# Altium schematic sheet MCU.SchDoc (part 1 of 3)
size A2; SheetNumber: 2; SheetTotal: 8
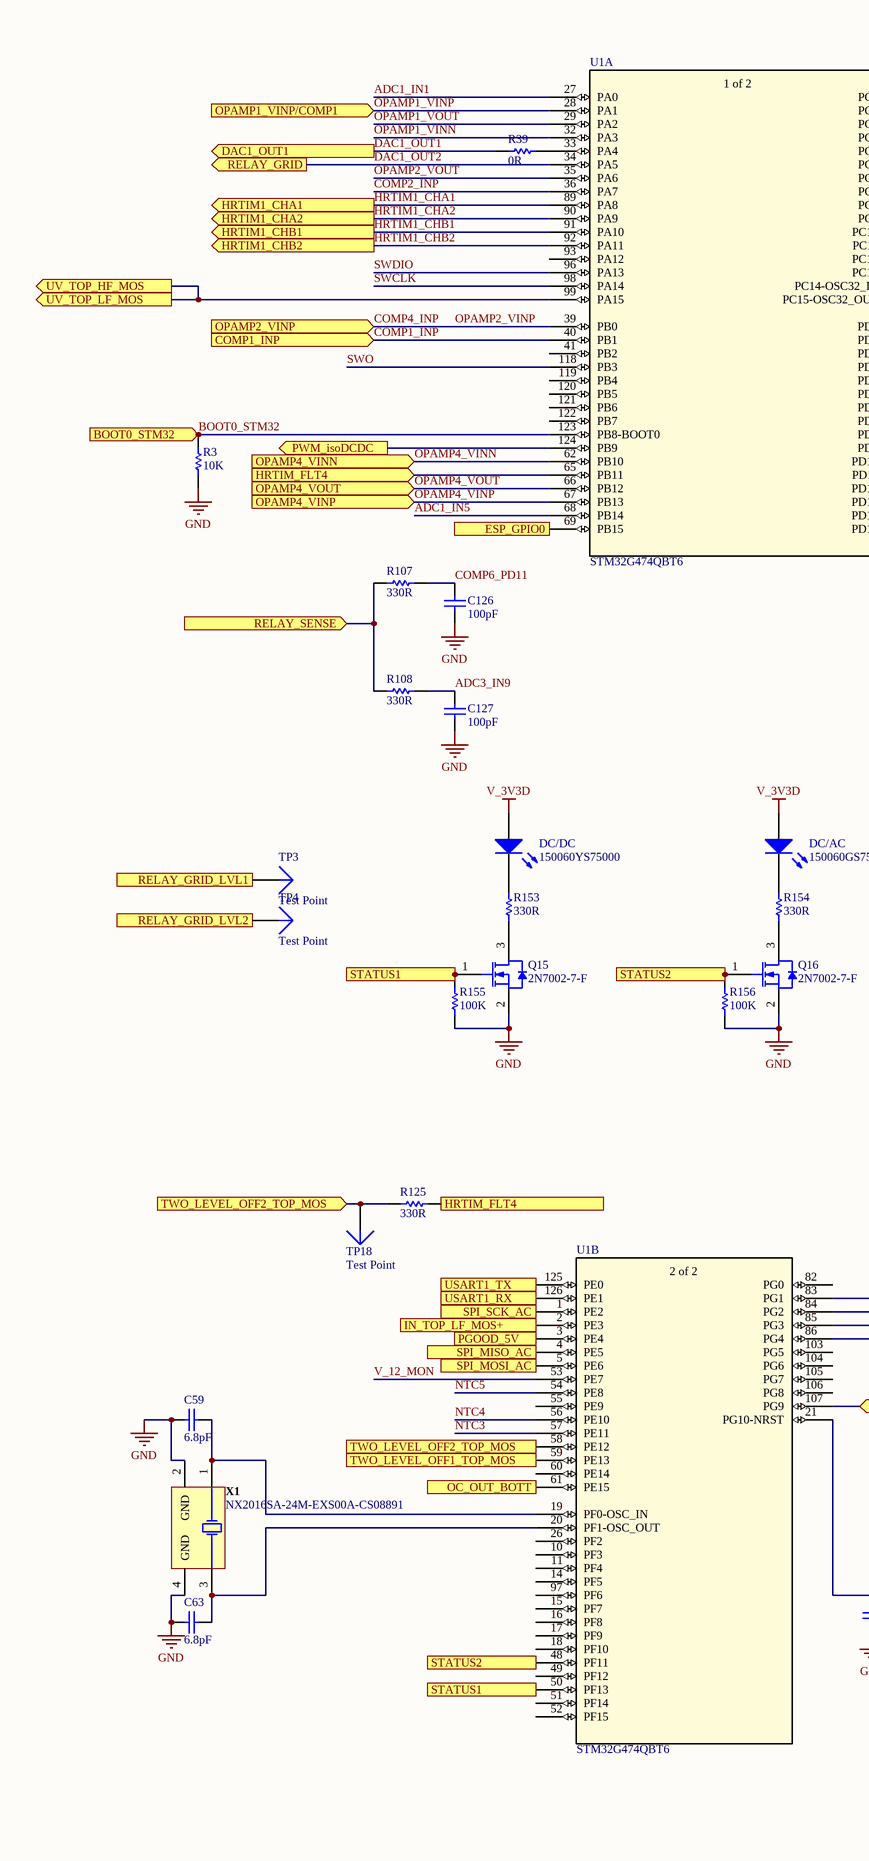
[diagram p0: MCU.SchDoc, left]
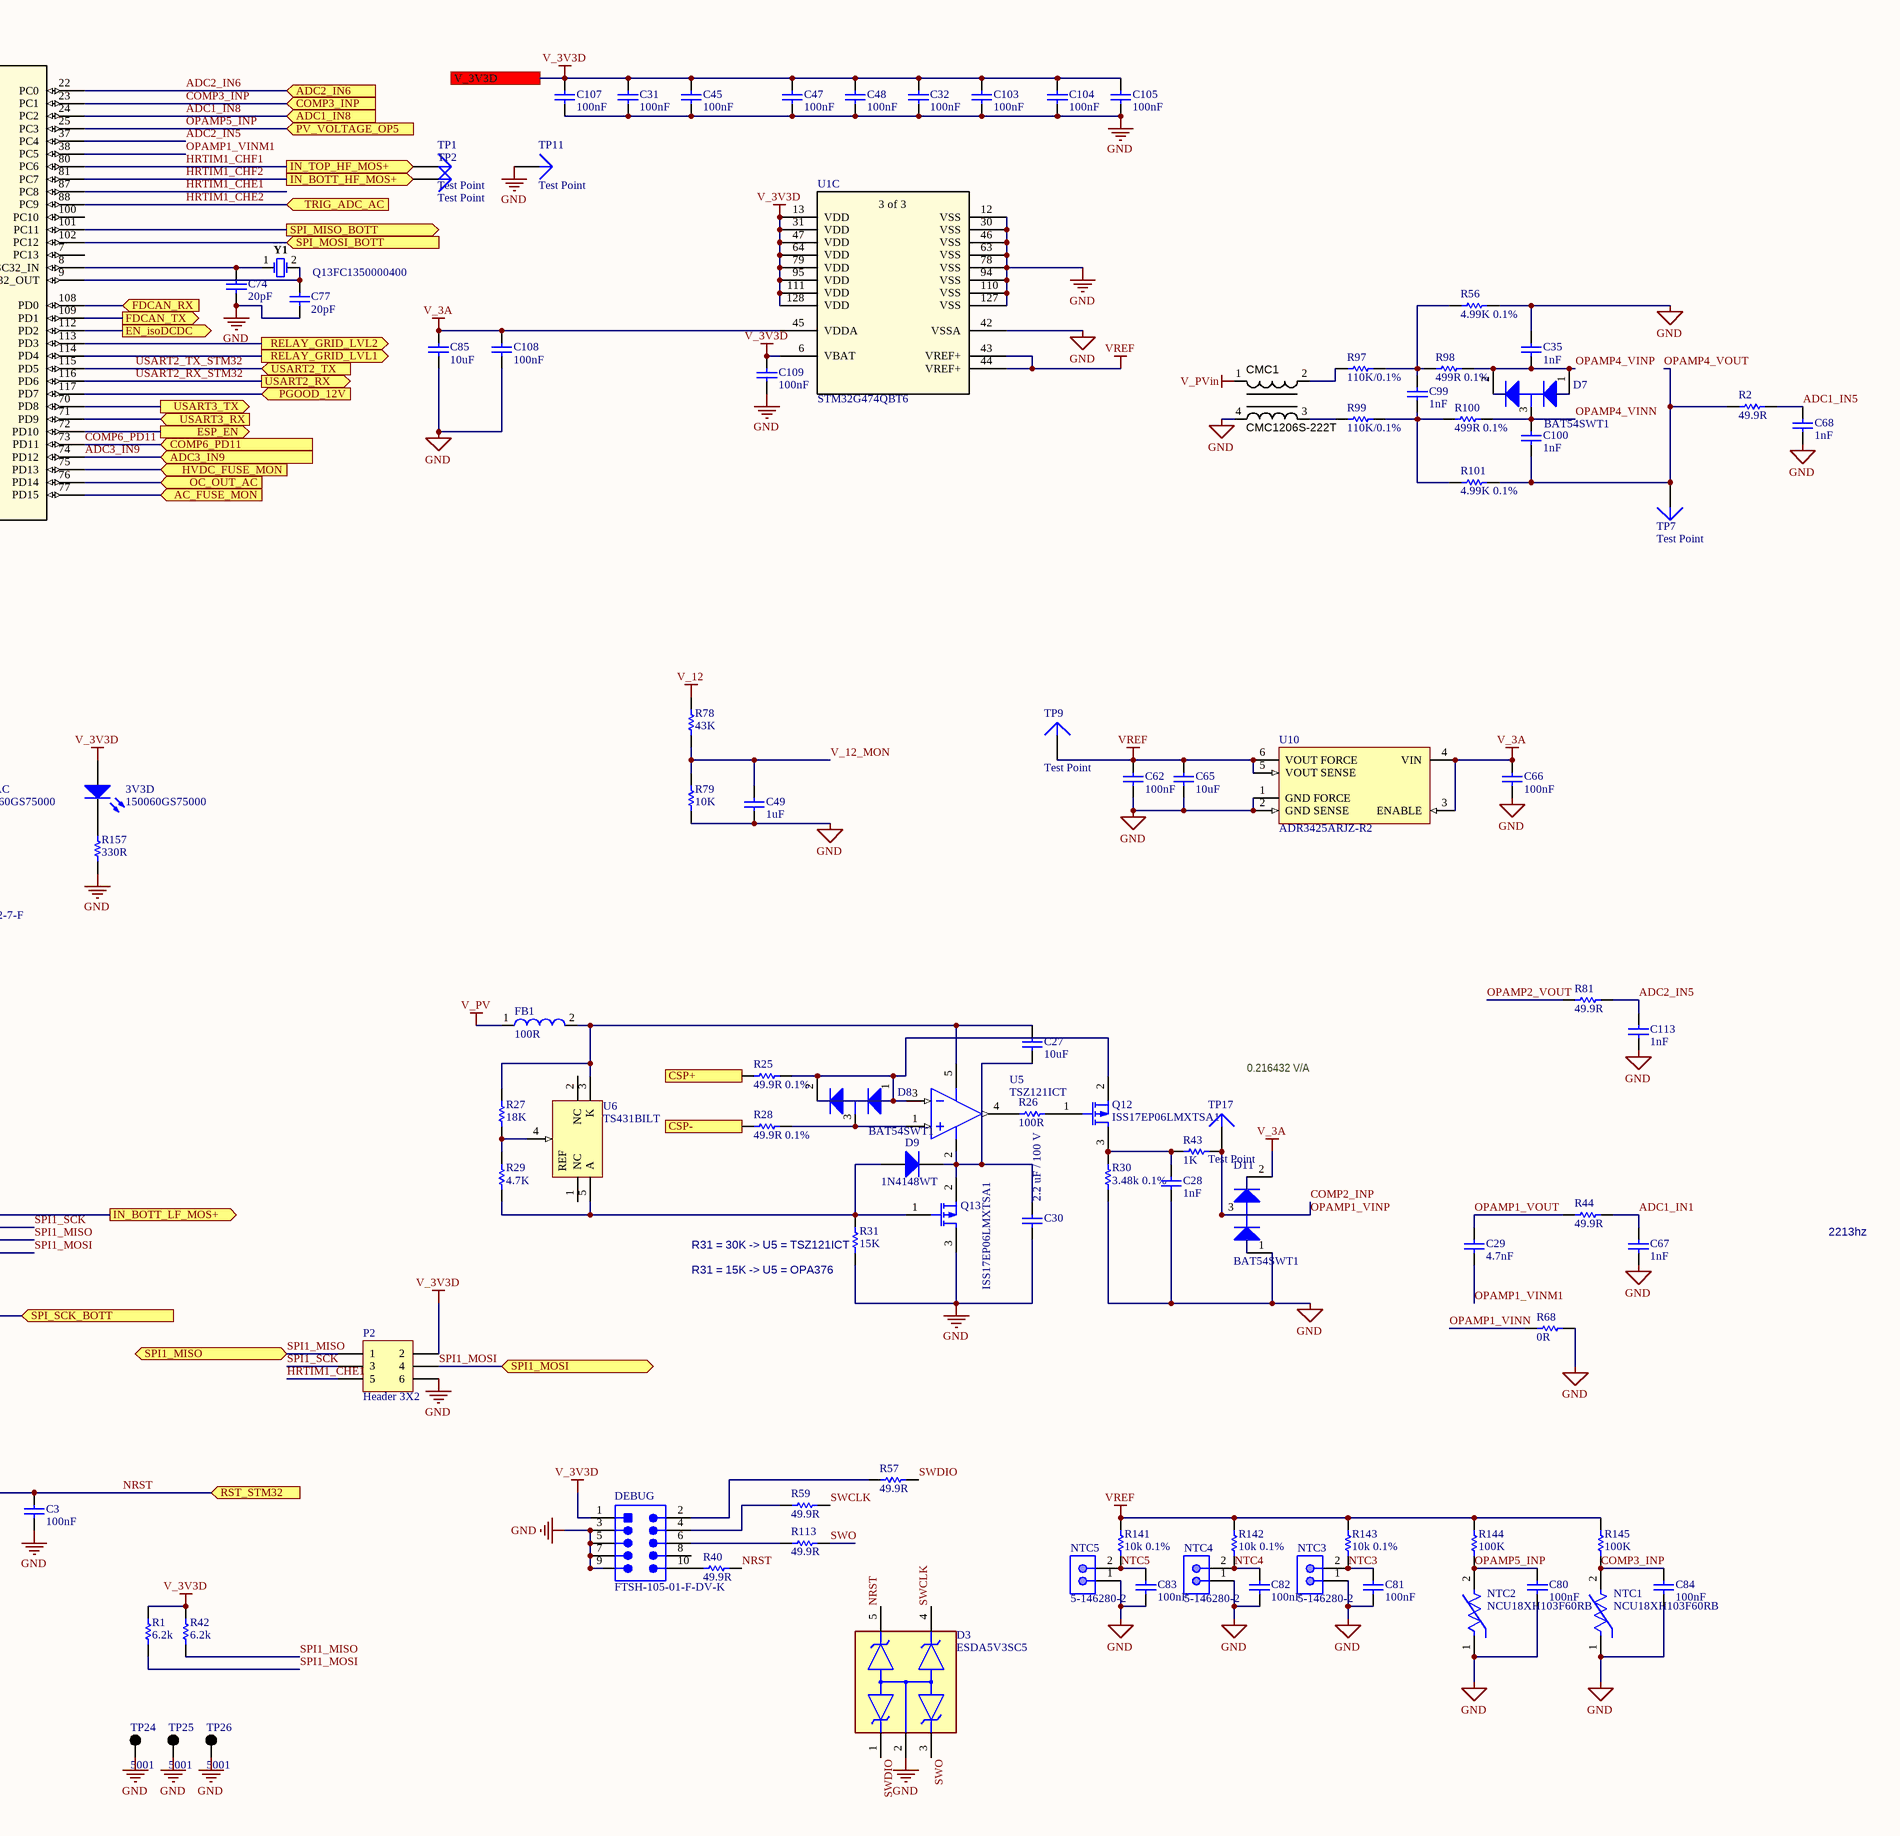
[diagram p1: MCU.SchDoc, right]

## Parts
3V3D  150060GS75000  [0603_A]
C3  100nF  [CAPC1005X56X25NL10T15]
C27  10uF  [CAPC2013X140X45NL15T25]
C28  1nF  [CAPC1608X90X35NL15T15]
C29  4.7nF  [CAPC1608X90X20NL10]
C30  2.2 uF / 100 V  [CAPC3225X250X20LL40]
C31  100nF  [CAPC1608X90X35NL10T15]
C32  100nF  [CAPC1608X90X35NL10T15]
C35  1nF  [CAPC1608X90X35NL15T15]
C45  100nF  [CAPC1608X90X35NL10T15]
C47  100nF  [CAPC1608X90X35NL10T15]
C48  100nF  [CAPC1608X90X35NL10T15]
C49  1uF  [CAPC1608X86X35NL15T15]
C59  6.8pF  [CAPC1005X56X25LL10T15]
C62  100nF  [CAPC1005X56X25NL10T15]
C63  6.8pF  [CAPC1005X56X25LL10T15]
C65  10uF  [CAPC1608X90X40NL10T20]
C66  100nF  [CAPC1608X90X35NL10T15]
C67  1nF  [CAPC1005X56X25NL10T15]
C68  1nF  [CAPC1608X90X35NL15T15]
C74  20pF  [CAPC1005X55X25ML05T10]
C77  20pF  [CAPC1005X55X25ML05T10]
C80  100nF  [CAPC1608X90X35NL10T15]
C81  100nF  [CAPC1608X90X35NL10T15]
C82  100nF  [CAPC1608X90X35NL10T15]
C83  100nF  [CAPC1608X90X35NL10T15]
C84  100nF  [CAPC1608X90X35NL10T15]
C85  10uF  [CAPC2013X140X45NL15T25]
C99  1nF  [CAPC1608X90X35NL15T15]
C100  1nF  [CAPC1608X90X35NL15T15]
C103  100nF  [CAPC1608X90X35NL10T15]
C104  100nF  [CAPC1608X90X35NL10T15]
C105  100nF  [CAPC1608X90X35NL10T15]
C107  100nF  [CAPC1608X90X35NL10T15]
C108  100nF  [CAPC1608X90X35NL10T15]
C109  100nF  [CAPC1608X90X35NL10T15]
C113  1nF  [CAPC1005X56X25NL10T15]
C126  100pF  [CAPC1608X90X35NL10T15]
C127  100pF  [CAPC1608X90X35NL10T15]
CMC1  CMC1206S-222T  [CHOKE_CM_1206SMD]
D3  ESDA5V3SC5  [FP-SOT323-5L-MFG]
D7  BAT54SWT1  [ONSC-SOT-323-3-419-04_V]
D8  BAT54SWT1  [ONSC-SOT-323-3-419-04_V]
D9  1N4148WT  [FAIR-SOD-523F-2_V]
D11  BAT54SWT1  [ONSC-SOT-323-3-419-04_V]
DC/AC  150060GS75000  [0603_A]
DC/DC  150060YS75000  [0603_A]
DEBUG  FTSH-105-01-F-DV-K  [SMTC-FTSH-105-01-L-DV-K_V]
FB1  100R  [SMD-0603]
NTC1  NCU18XH103F60RB  [FP-NCU18-0_15-MFG]
NTC2  NCU18XH103F60RB  [FP-NCU18-0_15-MFG]
NTC3  5-146280-2  [TECO-5-146280-2_V]
NTC4  5-146280-2  [TECO-5-146280-2_V]
NTC5  5-146280-2  [TECO-5-146280-2_V]
P2  Header 3X2  [HDR2X3]
Q12  ISS17EP06LMXTSA1  [INF-PG-SOT23_N]
Q13  ISS17EP06LMXTSA1  [INF-PG-SOT23_N]
Q15  2N7002-7-F  [DIOD-SOT23-3_V]
Q16  2N7002-7-F  [DIOD-SOT23-3_V]
R1  6.2k  [RESC1608X55X25ML10T15]
R2  49.9R  [RESC1608X55X30ML15T15]
R3  10K  [RESC1608X55X25NL10T15]
R25  49.9R 0.1%  [RESC1608X55X25ML10T15]
R26  100R  [RESC1608X55X30LL15T15]
R27  18K  [RESC1608X55X30NL20T20]
R28  49.9R 0.1%  [RESC1608X55X25ML10T15]
R29  4.7K  [RESC1608X55X30ML15T15]
R30  3.48k 0.1%  [RESC1608X55X30NL20T20]
R31  15K  [RESC1608X55X30NL15T15]
R39  0R  [RESC1608X55X25ML10T15]
R40  49.9R  [RESC1608X55X30NL15T15]
R42  6.2k  [RESC1608X55X25ML10T15]
R43  1K  [RESC1608X55X30NL15T15]
R44  49.9R  [RESC1608X55X30NL15T15]
R56  4.99K 0.1%  [RESC1608X55X30ML20T20]
R57  49.9R  [RESC1608X55X30NL15T15]
R59  49.9R  [RESC1608X55X30NL15T15]
R68  0R  [RESC1608X55X25ML10T15]
R78  43K  [RESC1608X55X30NL20T20]
R79  10K  [RESC1608X55X25NL10T15]
R81  49.9R  [RESC1005X40X25NL05T05]
R97  110K/0.1%  [RESC1608X55X30NL20T20]
R98  499R 0.1%  [RESC1608X55N]
R99  110K/0.1%  [RESC1608X55X30NL20T20]
R100  499R 0.1%  [RESC1608X55N]
R101  4.99K 0.1%  [RESC1608X55X30ML20T20]
R107  330R  [RESC1608X55X25NL10T15]
R108  330R  [RESC1608X55X25NL10T15]
R113  49.9R  [RESC1608X55X30NL15T15]
R125  330R  [RESC1608X55X25NL10T15]
R141  10k 0.1%  [RESC1608X55X30ML20T20]
R142  10k 0.1%  [RESC1608X55X30ML20T20]
R143  10k 0.1%  [RESC1608X55X30ML20T20]
R144  100K  [RESC1608X55X25NL10T15]
R145  100K  [RESC1608X55X25NL10T15]
R153  330R  [RESC1608X55X25NL10T15]
R154  330R  [RESC1608X55X25NL10T15]
R155  100K  [RESC1608X55X25ML10T15]
R156  100K  [RESC1608X55X25ML10T15]
R157  330R  [RESC1608X55X25NL10T15]
TP1  Test Point  [TP1.5mm]
TP2  Test Point  [TP1.5mm]
TP3  Test Point  [TP1.5mm]
TP4  Test Point  [TP1.5mm]
TP7  Test Point  [TP1.5mm]
TP9  Test Point  [TP1.5mm]
TP11  Test Point  [TP1.5mm]
TP17  Test Point  [TP1.5mm]
TP18  Test Point  [TP1.5mm]
TP24  5001  [KSTN-5001]
TP25  5001  [KSTN-5001]
TP26  5001  [KSTN-5001]
U1  STM32G474QBT6  [LQFP-128]  (parts A,B,C of 3)
U5  TSZ121ICT  [DCK0005A_N]
U6  TS431BILT  [SOT23-5]
U10  ADR3425ARJZ-R2  [SOT23-6]
X1  NX2016SA-24M-EXS00A-CS08891  [ABRA-ABM11_V]
Y1  Q13FC1350000400  [ABRA-ABS07_A_V]

## Ports
AC_FUSE_MON (in), ADC1_IN8 (in), ADC2_IN6 (in), ADC3_IN9 (in), BOOT0_STM32 (in), COMP1_INP (in), COMP3_INP (in), COMP6_PD11 (in), CSP+ (in), CSP- (in), DAC1_OUT1 (out), EN_isoDCDC (out), ESP_EN (out), ESP_GPIO0 (out), FDCAN_RX (in), FDCAN_TX (out), HRTIM1_CHA1 (out), HRTIM1_CHA2 (out), HRTIM1_CHB1 (out), HRTIM1_CHB2 (out), HRTIM_FLT4 (in), HRTIM_FLT4 (out), HVDC_FUSE_MON (in), IN_BOTT_HF_MOS+ (out), IN_BOTT_LF_MOS+ (out), IN_TOP_HF_MOS+ (out), IN_TOP_LF_MOS+ (out), OC_OUT_AC (in), OC_OUT_BOTT (in), OPAMP1_VINP/COMP1 (in), OPAMP2_VINP (in), OPAMP4_VINN (in), OPAMP4_VINP (in), OPAMP4_VOUT (in), PGOOD_5V (in), PGOOD_12V (in), PV_VOLTAGE_OP5 (in), PWM_isoDCDC (out), RELAY_GRID (out), RELAY_GRID_LVL1 (in), RELAY_GRID_LVL1 (out), RELAY_GRID_LVL2 (in), RELAY_GRID_LVL2 (out), RELAY_SENSE (in), RST_STM32 (in), SPI1_MISO (bidir), SPI1_MOSI (bidir), SPI_MISO_AC (in), SPI_MISO_BOTT (out), SPI_MOSI_AC (out), SPI_MOSI_BOTT (in), SPI_SCK_AC (out), SPI_SCK_BOTT (in), STATUS1 (in), STATUS2 (in), TRIG_ADC_AC (in), TWO_LEVEL_OFF1_TOP_MOS (in), TWO_LEVEL_OFF2_TOP_MOS (in), USART1_RX (in), USART1_TX (out), USART2_RX (out), USART2_TX (in), USART3_RX (in), USART3_TX (out), UV_TOP_HF_MOS (out), UV_TOP_LF_MOS (out), V_3V3D

## Nets
GND: C3.1 C28.1 C30.1 C31.1 C32.1 C35.2 C45.1 C47.1 C48.1 C49.1 C59.1 C62.1 C63.1 C65.1 C66.1 C67.1 C68.1 C74.1 C77.1 C80.1 C81.1 C82.1 C83.1 C84.1 C85.1 C103.1 C104.1 C105.1 C107.1 C108.1 C109.1 C113.1 C126.1 C127.1 CMC1.4 D3.2(COMMON_ANODE) D11.1(A) DEBUG.3 DEBUG.5 DEBUG.7 DEBUG.9 NTC1.1 NTC2.1 NTC3.1 NTC4.1 NTC5.1 P2.6 Q13.3(D) Q15.2(S) Q16.2(S) R3.1 R30.1 R31.1 R56.1 R68.1 R79.1 R155.1 R156.1 R157.2 TP11.1 TP24.1 TP25.1 TP26.1 U1.12(VSS) U1.30(VSS) U1.42(VSSA) U1.46(VSS) U1.63(VSS) U1.78(VSS) U1.94(VSS) U1.110(VSS) U1.127(VSS) U10.1(GND_FORCE) U10.2(GND_SENSE) X1.2(GND) X1.4(GND)
V_3A: C66.2 C85.2 C108.2 D11.2(K) U1.45(VDDA) U10.3(ENABLE) U10.4(VIN)
V_3V3D: 3V3D.2(A) C31.2 C32.2 C45.2 C47.2 C48.2 C103.2 C104.2 C105.2 C107.2 C109.2 DC/AC.2(A) DC/DC.2(A) DEBUG.1 P2.2 R1.1 R42.1 U1.6(VBAT) U1.13(VDD) U1.31(VDD) U1.47(VDD) U1.64(VDD) U1.79(VDD) U1.95(VDD) U1.111(VDD) U1.128(VDD) ; port V_3V3D
V_12: R78.2
V_PV: FB1.1
V_PVin: CMC1.1
VREF: C62.2 C65.2 R141.2 R142.2 R143.2 R144.2 R145.2 TP9.1 U1.43(VREF+) U1.44(VREF+) U10.5(VOUT_SENSE) U10.6(VOUT_FORCE)
AC_FUSE_MON: U1.77(PD15) ; port AC_FUSE_MON
ADC1_IN1: C67.2 R44.2 U1.27(PA0)
ADC1_IN5: C68.2 R2.2 U1.68(PB14)
ADC1_IN8: U1.24(PC2) ; port ADC1_IN8
ADC2_IN5: C113.2 R81.2 U1.37(PC4)
ADC2_IN6: U1.22(PC0) ; port ADC2_IN6
ADC3_IN9: C127.2 R108.2 U1.74(PD12) ; port ADC3_IN9
BOOT0_STM32: R3.2 U1.123(PB8-BOOT0) ; port BOOT0_STM32
COMP1_INP: U1.40(PB1) ; port COMP1_INP
COMP2_INP: D11.3(K/A) R43.1 TP17.1 U1.28(PA1) U1.36(PA7) ; port OPAMP1_VINP/COMP1  [also labelled OPAMP1_VINP]
COMP3_INP: C84.2 NTC1.2 R145.1 U1.23(PC1) ; port COMP3_INP
COMP4_INP: U1.39(PB0) ; port OPAMP2_VINP  [also labelled OPAMP2_VINP]
COMP6_PD11: C126.2 R107.2 U1.73(PD11) ; port COMP6_PD11
CSP+: R25.1 ; port CSP+
CSP-: R28.1 ; port CSP-
DAC1_OUT1: R39.2 ; port DAC1_OUT1
DAC1_OUT2: U1.34(PA5) ; port RELAY_GRID
EN_isoDCDC: U1.112(PD2) ; port EN_isoDCDC
ESP_EN: U1.72(PD10) ; port ESP_EN
ESP_GPIO0: U1.69(PB15) ; port ESP_GPIO0
FDCAN_RX: U1.108(PD0) ; port FDCAN_RX
FDCAN_TX: U1.109(PD1) ; port FDCAN_TX
HRTIM1_CHA1: U1.89(PA8) ; port HRTIM1_CHA1
HRTIM1_CHA2: U1.90(PA9) ; port HRTIM1_CHA2
HRTIM1_CHB1: U1.91(PA10) ; port HRTIM1_CHB1
HRTIM1_CHB2: U1.92(PA11) ; port HRTIM1_CHB2
HRTIM1_CHE1: P2.5 U1.87(PC8)
HRTIM1_CHE2: U1.88(PC9) ; port TRIG_ADC_AC
HRTIM1_CHF1: TP1.1 U1.80(PC6) ; port IN_TOP_HF_MOS+
HRTIM1_CHF2: TP2.1 U1.81(PC7) ; port IN_BOTT_HF_MOS+
HRTIM_FLT4: R125.2 U1.65(PB11) ; port HRTIM_FLT4
HVDC_FUSE_MON: U1.75(PD13) ; port HVDC_FUSE_MON
IN_BOTT_LF_MOS+: U1.83(PG1) ; port IN_BOTT_LF_MOS+
IN_TOP_LF_MOS+: U1.2(PE3) ; port IN_TOP_LF_MOS+
NRST: C3.2 D3.5(4_CATHODE) R40.2 U1.21(PG10-NRST) ; port RST_STM32
NTC3: C81.2 NTC3.2 R143.1 U1.57(PE11)
NTC4: C82.2 NTC4.2 R142.1 U1.56(PE10)
NTC5: C83.2 NTC5.2 R141.1 U1.54(PE8)
OC_OUT_AC: U1.76(PD14) ; port OC_OUT_AC
OC_OUT_BOTT: U1.61(PE15) ; port OC_OUT_BOTT
OPAMP1_VINM1: C29.1 U1.38(PC5)
OPAMP1_VINN: R68.2 U1.32(PA3)
OPAMP1_VOUT: C29.2 R44.1 U1.29(PA2)
OPAMP2_VOUT: R81.1 U1.35(PA6)
OPAMP4_VINN: C100.2 D7.3(K/A) R100.2 U1.62(PB10) ; port OPAMP4_VINN
OPAMP4_VINP: C35.1 D7.1(A) D7.2(K) R98.2 U1.67(PB13) ; port OPAMP4_VINP
OPAMP4_VOUT: C100.1 R2.1 R101.1 TP7.1 U1.66(PB12) ; port OPAMP4_VOUT
OPAMP5_INP: C80.2 NTC2.2 R144.1 U1.25(PC3) ; port PV_VOLTAGE_OP5
PGOOD_5V: U1.3(PE4) ; port PGOOD_5V
PGOOD_12V: U1.117(PD7) ; port PGOOD_12V
PWM_isoDCDC: U1.124(PB9) ; port PWM_isoDCDC
RELAY_GRID_LVL1: TP3.1 U1.114(PD4) ; port RELAY_GRID_LVL1
RELAY_GRID_LVL2: TP4.1 U1.113(PD3) ; port RELAY_GRID_LVL2
RELAY_SENSE: R107.1 R108.1 ; port RELAY_SENSE
SPI1_MISO: P2.1 R42.2 U1.85(PG3) ; port SPI1_MISO
SPI1_MOSI: P2.4 R1.2 U1.86(PG4) ; port SPI1_MOSI
SPI1_SCK: P2.3 U1.84(PG2)
SPI_MISO_AC: U1.4(PE5) ; port SPI_MISO_AC
SPI_MISO_BOTT: U1.101(PC11) ; port SPI_MISO_BOTT
SPI_MOSI_AC: U1.5(PE6) ; port SPI_MOSI_AC
SPI_MOSI_BOTT: U1.102(PC12) ; port SPI_MOSI_BOTT
SPI_SCK_AC: U1.1(PE2) ; port SPI_SCK_AC
SPI_SCK_BOTT: U1.107(PG9) ; port SPI_SCK_BOTT
STATUS1: Q15.1(G) R155.2 U1.50(PF13) ; port STATUS1
STATUS2: Q16.1(G) R156.2 U1.48(PF11) ; port STATUS2
SWCLK: D3.4(3_CATHODE) R59.2 U1.98(PA14)
SWDIO: D3.1(1_CATHODE) R57.2 U1.96(PA13)
SWO: D3.3(2_CATHODE) R113.2 U1.118(PB3)
TWO_LEVEL_OFF1_TOP_MOS: U1.59(PE13) ; port TWO_LEVEL_OFF1_TOP_MOS
TWO_LEVEL_OFF2_TOP_MOS: R125.1 TP18.1 U1.58(PE12) ; port TWO_LEVEL_OFF2_TOP_MOS
USART1_RX: U1.126(PE1) ; port USART1_RX
USART1_TX: U1.125(PE0) ; port USART1_TX
USART2_RX_STM32: U1.116(PD6) ; port USART2_RX
USART2_TX_STM32: U1.115(PD5) ; port USART2_TX
USART3_RX: U1.71(PD9) ; port USART3_RX
USART3_TX: U1.70(PD8) ; port USART3_TX
UV_TOP_HF_MOS: U1.99(PA15) ; port UV_TOP_HF_MOS, port UV_TOP_LF_MOS
V_12_MON: C49.2 R78.1 R79.2 U1.53(PE7)
Net3V3D_1: 3V3D.1(K) R157.1
NetC27_1: C27.1 FB1.2 R27.2 U5.5(V+) U6.3(K)
NetC27_2: C27.2 C30.2 D9.1(K) Q13.2(S) U5.2(V-)
NetC28_2: C28.2 Q12.3(D) R30.2 R43.2
NetC59_2: C59.2 U1.19(PF0-OSC_IN) X1.1(X1)
NetC63_2: C63.2 U1.20(PF1-OSC_OUT) X1.3(X2)
NetC74_2: C74.2 U1.8(PC14-OSC32_IN) Y1.1
NetC77_2: C77.2 U1.9(PC15-OSC32_OUT) Y1.2
NetC99_1: C99.1 R99.1 R100.1 R101.2
NetC99_2: C99.2 R56.2 R97.1 R98.1
NetCMC1_2: CMC1.2 R97.2
NetCMC1_3: CMC1.3 R99.2
NetD8_1: D8.1(A) D8.2(K) Q12.2(S) R25.2 U5.3(IN-)
NetD8_3: D8.3(K/A) R28.2 U5.1(IN+)
NetD9_2: D9.2(A) Q13.1(G) R29.1 R31.2 U6.5(A)
NetDC/AC_1: DC/AC.1(K) R154.1
NetDC/DC_1: DC/DC.1(K) R153.1
NetDEBUG_2: DEBUG.2 R57.1
NetDEBUG_4: DEBUG.4 R59.1
NetDEBUG_6: DEBUG.6 R113.1
NetDEBUG_10: DEBUG.10 R40.1
NetQ12_1: Q12.1(G) R26.2
NetQ15_3: Q15.3(D) R153.2
NetQ16_3: Q16.3(D) R154.2
NetR26_1: R26.1 U5.4(OUT)
NetR27_1: R27.1 R29.2 U6.4(REF)
NetR39_1: R39.1 U1.33(PA4)

Not connected (* = marked no-connect by the designer): DEBUG 8; U1 7(PC13) 10(PF3) 11(PF4) 14(PF5) 15(PF7) 16(PF8) 17(PF9) 18(PF10) 26(PF2) 41(PB2) 49(PF12) 51(PF14) 52(PF15) 55(PE9) 60(PE14) 82(PG0) 93(PA12) 97(PF6) 100(PC10) 103(PG5) 104(PG6) 105(PG7) 106(PG8) 119(PB4) 120(PB5) 121(PB6) 122(PB7); U6 1(NC) 2(NC)

## Notes on the sheet
- 0.216432 V/A
- (near R31) R31 = 30K -> U5 = TSZ121ICT
- (near R31) R31 = 15K -> U5 = OPA376
- 2213hz
- (in symbol STM32G4_LPQFP128, part A) 1 of 2
- (in symbol STM32G4_LPQFP128, part B) 2 of 2
- (in symbol STM32G4_LPQFP128, part C) 3 of 3